# Altium schematic sheet led4.SchDoc
size A4; DocumentNumber: 4; SheetNumber: 4; SheetTotal: 8
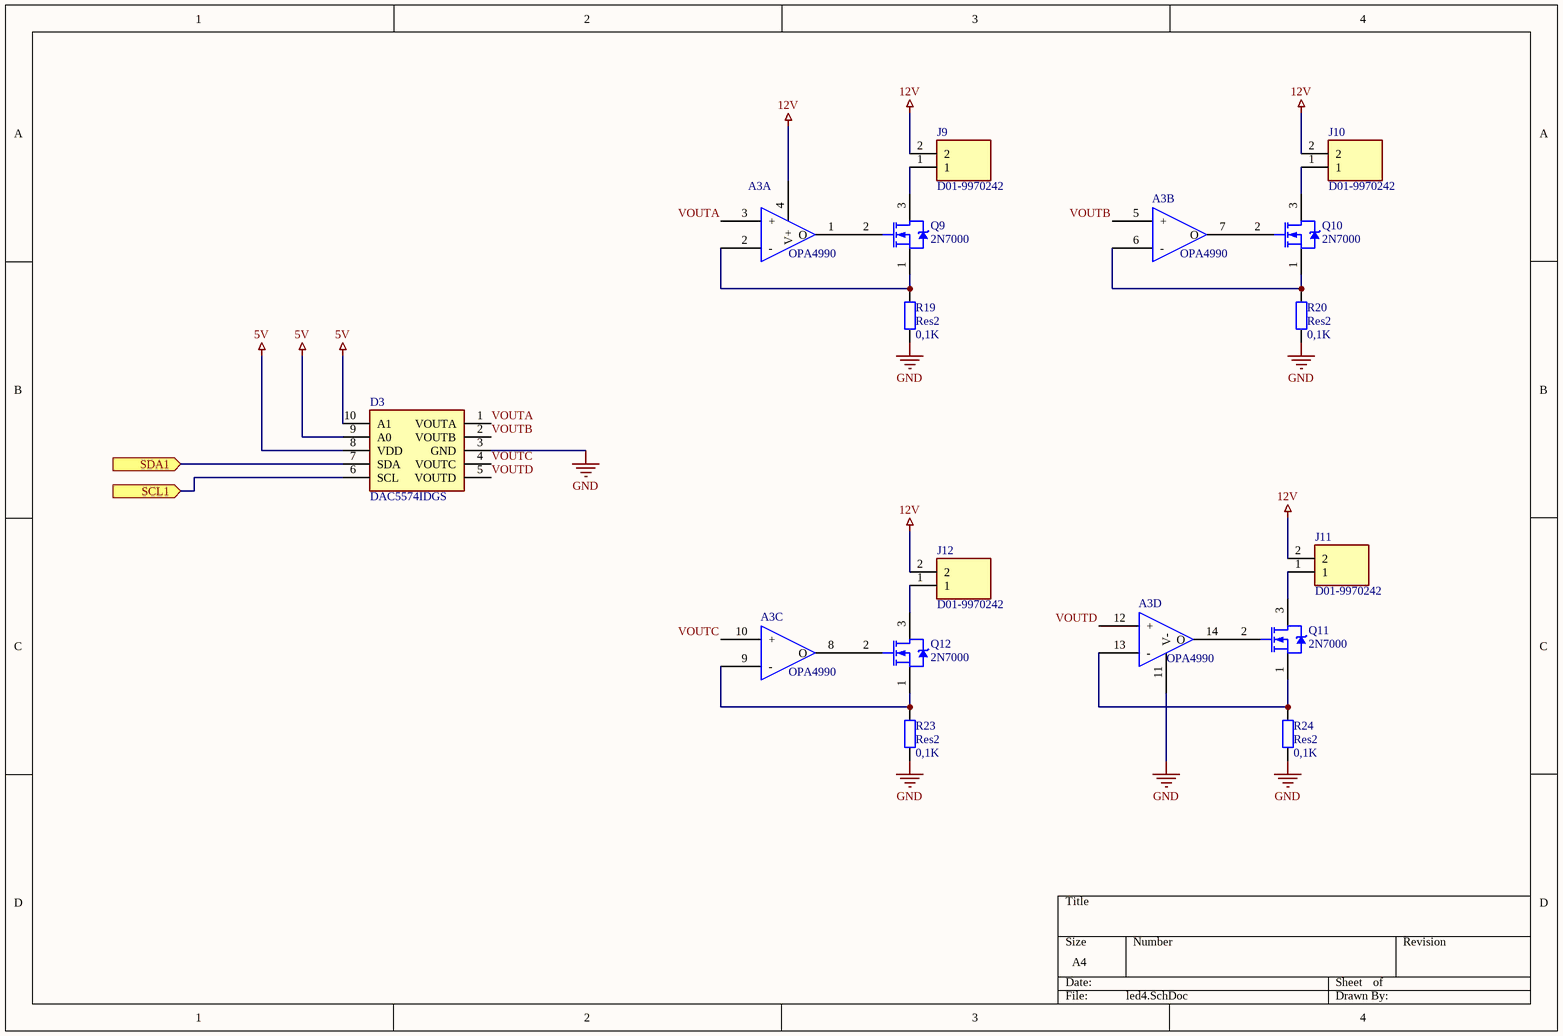
[diagram p0: led4.SchDoc]

## Parts
A3  OPA4990  [SOIC127P600X175-14N]  (parts A,B,C,D of 4)
D3  DAC5574IDGS  [SOP50P490X110-10N]
J9  D01-9970242  [HDR1X2]
J10  D01-9970242  [HDR1X2]
J11  D01-9970242  [HDR1X2]
J12  D01-9970242  [HDR1X2]
Q9  2N7000  [ONSC-TO-92-3-29-11]
Q10  2N7000  [ONSC-TO-92-3-29-11]
Q11  2N7000  [ONSC-TO-92-3-29-11]
Q12  2N7000  [ONSC-TO-92-3-29-11]
R19  Res2  value 0,1K  [C1210]
R20  Res2  value 0,1K  [C1210]
R23  Res2  value 0,1K  [C1210]
R24  Res2  value 0,1K  [C1210]

## Ports
SCL1 (in), SDA1 (in)

## Nets
5V: D3.8(VDD) D3.9(A0) D3.10(A1)
12V: A3.4(V+) J9.2 J10.2 J11.2 J12.2
GND: A3.11(V-) D3.3(GND) R19.1 R20.1 R23.1 R24.1
SCL1: D3.6(SCL) ; port SCL1
SDA1: D3.7(SDA) ; port SDA1
VOUTA: A3.3(+) D3.1(VOUTA)
VOUTB: A3.5(+) D3.2(VOUTB)
VOUTC: A3.10(+) D3.4(VOUTC)
VOUTD: A3.12(+) D3.5(VOUTD)
NetA3_1: A3.1(O) Q9.2(G)
NetA3_2: A3.2(-) Q9.1(S) R19.2
NetA3_6: A3.6(-) Q10.1(S) R20.2
NetA3_7: A3.7(O) Q10.2(G)
NetA3_8: A3.8(O) Q12.2(G)
NetA3_9: A3.9(-) Q12.1(S) R23.2
NetA3_13: A3.13(-) Q11.1(S) R24.2
NetA3_14: A3.14(O) Q11.2(G)
NetJ9_1: J9.1 Q9.3(D)
NetJ10_1: J10.1 Q10.3(D)
NetJ11_1: J11.1 Q11.3(D)
NetJ12_1: J12.1 Q12.3(D)

## Library data of the parts
D3 = DAC5574IDGS: Integrated Circuit; Manufacturer_Name: Texas Instruments; Datasheet Link: http://www.ti.com/lit/gpn/dac5574; Height: 1.1mm; Manufacturer_Part_Number: DAC5574IDGS; Mouser Part Number: 595-DAC5574IDGS; Mouser Price/Stock: https://www.mouser.com/Search/Refine.aspx?Keyword=595-DAC5574IDGS; RS Part Number: 6621533P; RS Price/Stock: http://uk.rs-online.com/web/p/products/6621533P
J9-J12 = D01-9970242: Connector; Manufacturer_Name: HARWIN; Datasheet Link: https://componentsearchengine.com/Datasheets/1/D01-9970242.pdf; Height: 4.25mm; Manufacturer_Part_Number: D01-9970242; Mouser Part Number: 855-D01-9970242; Mouser Price/Stock: https://www.mouser.com/Search/Refine.aspx?Keyword=855-D01-9970242
Q9-Q12 = CMP-1058-00936-1: Small Signal MOSFET, 200 mA, 60 V, N-Channel, 3-Pin TO-92, Bulk Box; Manufacturer: On Semiconductor; Ciss Typ (pF): 60; VGS(th) Max (V): 3; Crss Typ (pF): 5; Channel Polarity: N Channel; VGS Max (V): 20; Configuration: Single; PD Max (W): 0.35; Coss Typ (pF): 25; ID Max (A): 0.2; PackageVersion: Rev. AM; ComponentLink3URL: http://www.onsemi.cn/pub_link/Collateral/2N6426-D.PDF; ComponentLink2URL: http://www.onsemi.com/pub_link/Collateral/2N7000-D.PDF; DatasheetVersion: Rev. 8; Mounting Technology: Through Hole; V(BR)DSS Min (V): 60; PartNumber: 2N7000; PackageDescription: 3-Pin Transistor Outline, Body 4.825 x 3.685 mm, Pitch 1.27 mm; ComponentLink2Description: Datasheet; ComponentLink1URL: http://www.onsemi.com/; PackageReference: TO-92-3-29-11_AM_SL; Packing: Bulk Box; ComponentLink1Description: Manufacturer URL; Package Type: TO-92; ComponentLink3Description: Package Specification
R19 R20 R23 R24 = Res2: Resistor; Published: 8-Jun-2000; LatestRevisionDate: 17-Jul-2002; LatestRevisionNote: Re-released for DXP Platform.; PackageReference: AXIAL-0.4; Publisher: Altium Limited; PackageDescription: Axial Device, Thru-Hole; 2 Leads; 0.4 in Pin Spacing